# EAGLE design Mega_Shield-v4 (EAGLE 6.5.0)
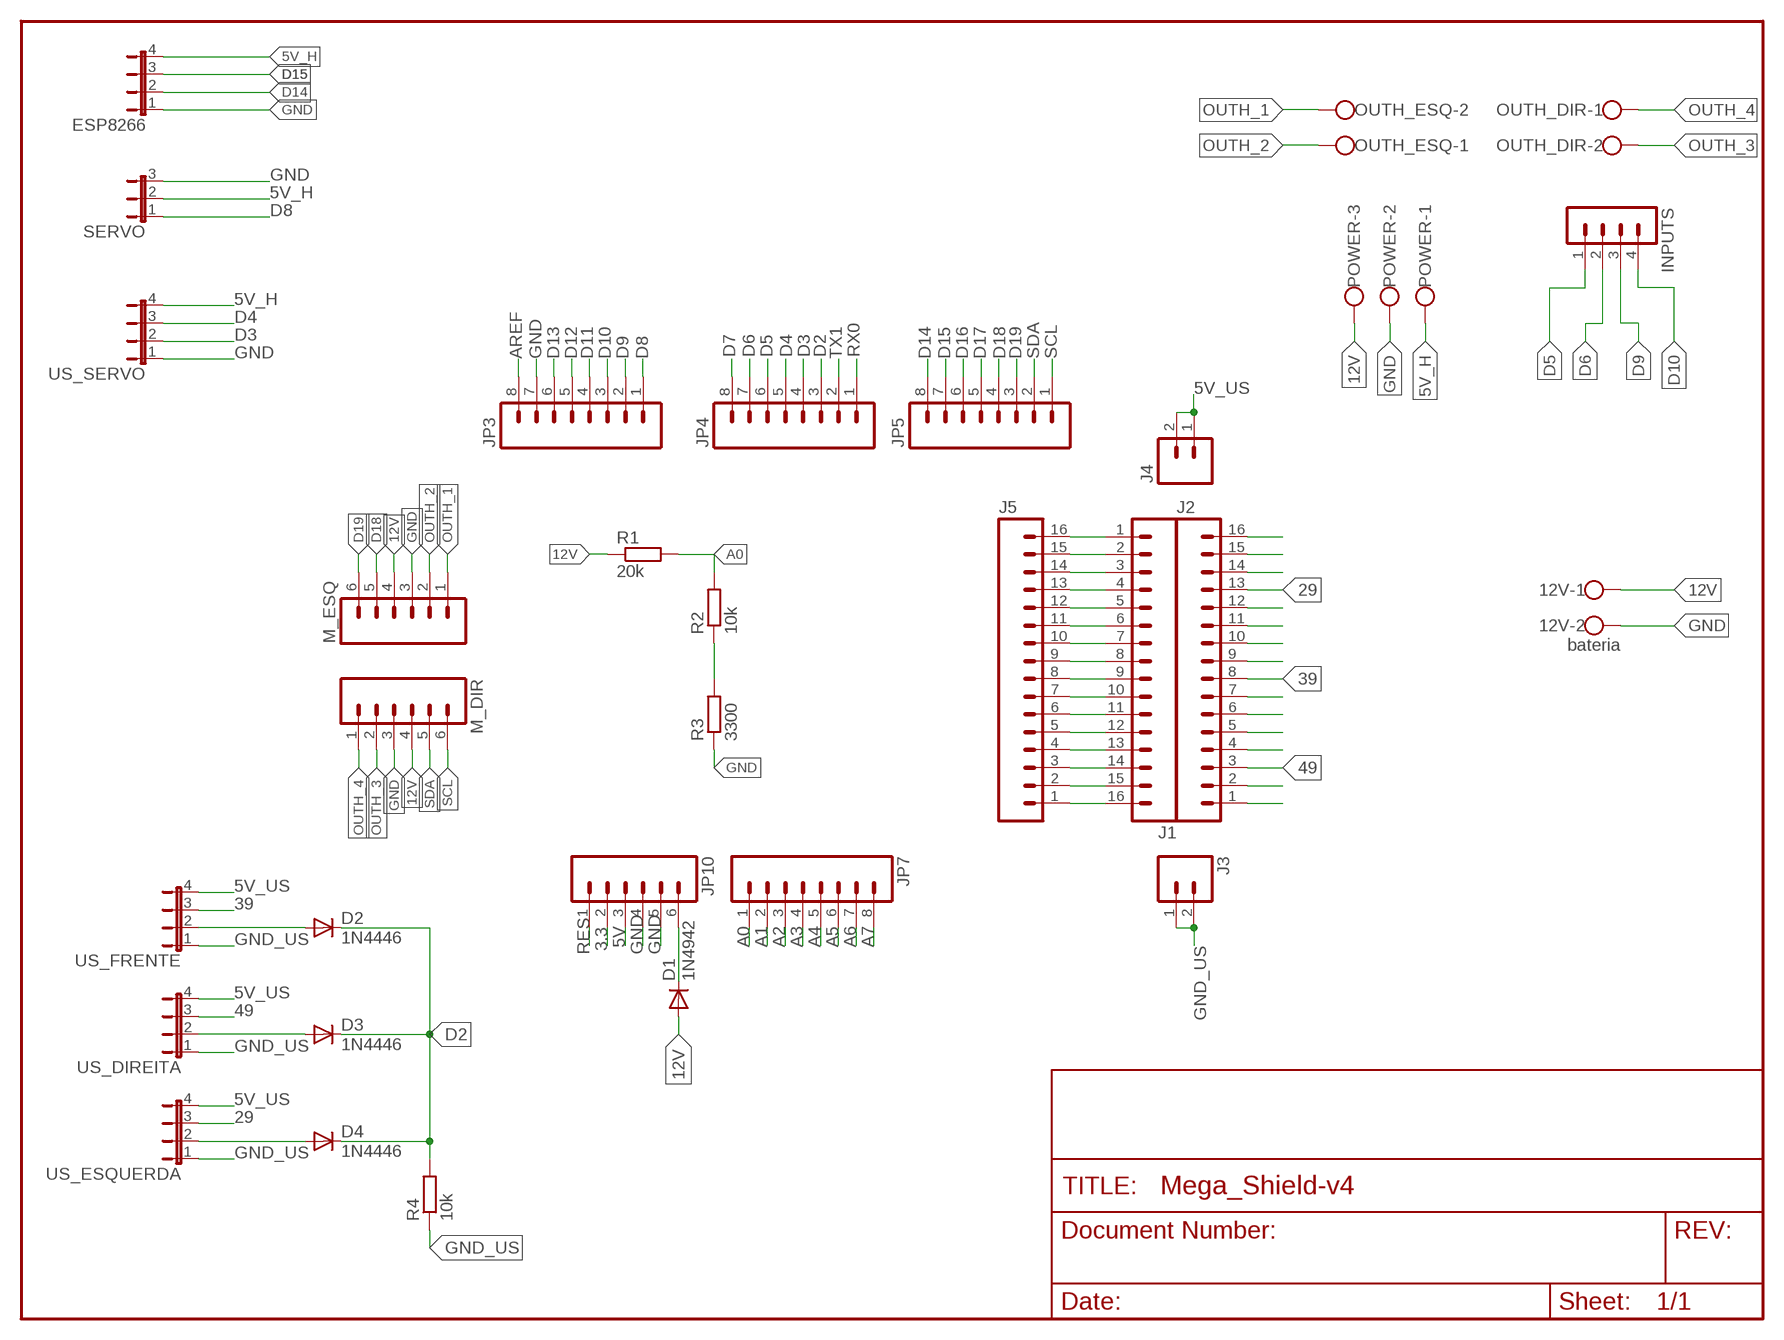
[diagram p0: schematic, sheet 1]

## Parts
12V  bateria  W237-102  [W237-102]
D1  1N4942  [DO41-10]
D2  1N4446  [DO35-10]
D3  1N4446  [DO35-10]
D4  1N4446  [DO35-10]
ESP8266  JP4E  [JP4]
INPUTS  MA04-1  [MA04-1]
J1  M16LOCK  [1X16_LOCK]
J2  M16LOCK  [1X16_LOCK]
J3  M02LOCK  [1X02_LOCK]
J4  M02LOCK  [1X02_LOCK]
J5  M16LOCK  [1X16_LOCK]
JP3  M08LOCK  [1X08_LOCK]
JP4  M08LOCK  [1X08_LOCK]
JP5  M08LOCK  [1X08_LOCK]
JP7  M08LOCK  [1X08_LOCK]
JP10  M06LOCK  [1X06_LOCK]
M_DIR  M06LOCK  [1X06_LOCK]
M_ESQ  M06LOCK  [1X06_LOCK]
OUTH_DIR  W237-102  [W237-102]
OUTH_ESQ  W237-102  [W237-102]
POWER  W237-103  [W237-103]
R1  20k  R-EU_0207/10  [0207/10]
R2  10k  R-EU_0207/10  [0207/10]
R3  3300  R-EU_0207/10  [0207/10]
R4  10k  R-EU_0207/10  [0207/10]
SERVO  JP2W  [JP2W]
US_DIREITA  JP4E  [JP4]
US_ESQUERDA  JP4E  [JP4]
US_FRENTE  JP4E  [JP4]
US_SERVO  JP4E  [JP4]

## Nets
3.3: JP10.2
5V: JP10.3
5V_H: ESP8266.4 POWER.1 SERVO.2 US_SERVO.4
5V_US: J4.1 J4.2 US_DIREITA.4 US_ESQUERDA.4 US_FRENTE.4
12V: 12V.1 D1.A M_DIR.4 M_ESQ.4 POWER.3 R1.1
29: J2.13 US_ESQUERDA.3
39: J2.8 US_FRENTE.3
49: J2.3 US_DIREITA.3
A0: JP7.1 R1.2 R2.2
A1: JP7.2
A2: JP7.3
A3: JP7.4
A4: JP7.5
A5: JP7.6
A6: JP7.7
A7: JP7.8
AREF: JP3.8
D2: D2.C D3.C D4.C JP4.3 R4.2
D3: JP4.4 US_SERVO.2
D4: JP4.5 US_SERVO.3
D5: INPUTS.1 JP4.6
D6: INPUTS.2 JP4.7
D7: JP4.8
D8: JP3.1 SERVO.1
D9: INPUTS.3 JP3.2
D10: INPUTS.4 JP3.3
D11: JP3.4
D12: JP3.5
D13: JP3.6
D14: ESP8266.2 JP5.8
D15: ESP8266.3 JP5.7
D16: JP5.6
D17: JP5.5
D18: JP5.4 M_ESQ.5
D19: JP5.3 M_ESQ.6
GND: 12V.2 ESP8266.1 JP3.7 JP10.4 JP10.5 M_DIR.3 M_ESQ.3 POWER.2 R3.1 SERVO.3 US_SERVO.1
GND_US: J3.1 J3.2 R4.1 US_DIREITA.1 US_ESQUERDA.1 US_FRENTE.1
N$2: R2.1 R3.2
N$8: D1.C JP10.6
N$10: J2.16
N$12: D2.A US_FRENTE.2
N$13: J1.16 J5.1
N$14: D3.A US_DIREITA.2
N$15: J2.15
N$16: J2.14
N$17: J1.15 J5.2
N$18: J1.14 J5.3
N$19: J2.12
N$20: J2.11
N$21: J1.13 J5.4
N$22: D4.A US_ESQUERDA.2
N$23: J2.10
N$25: J2.9
N$26: J1.12 J5.5
N$27: J2.7
N$28: J2.6
N$29: J2.5
N$30: J2.4
N$31: J1.11 J5.6
N$32: J2.2
N$33: J2.1
N$34: J1.10 J5.7
N$35: J1.9 J5.8
N$36: J1.8 J5.9
N$37: J1.7 J5.10
N$38: J1.6 J5.11
N$39: J1.5 J5.12
N$40: J1.4 J5.13
N$41: J1.3 J5.14
N$42: J1.2 J5.15
N$43: J1.1 J5.16
OUTH_1: M_ESQ.1 OUTH_ESQ.2
OUTH_2: M_ESQ.2 OUTH_ESQ.1
OUTH_3: M_DIR.2 OUTH_DIR.2
OUTH_4: M_DIR.1 OUTH_DIR.1
RES: JP10.1
RX0: JP4.1
SCL: JP5.1 M_DIR.6
SDA: JP5.2 M_DIR.5
TX1: JP4.2

## Library data of the parts
12V OUTH_DIR OUTH_ESQ = con-wago-500:W237-102: WAGO SCREW CLAMP; MPN: 237-102; OC_FARNELL: unknown; OC_NEWARK: 70K9898
D1 = diode:1N4942: DIODE 1.0 A, 200 V, 150 ns
D2-D4 = diode:1N4446: DIODE high speed (Philips)
ESP8266 US_DIREITA US_ESQUERDA US_FRENTE US_SERVO = jumper:JP4E: JUMPER
INPUTS = con-lstb:MA04-1: PIN HEADER; OC_FARNELL: unknown; OC_NEWARK: unknown
J1 J2 J5 = SparkFun-Connectors:M16: 1x16 .1" header
J3 J4 = SparkFun-Connectors:M02: Standard 2-pin 0.1" header. Use with - straight break away headers ( PRT-00116) - right angle break away headers (PRT-00553) - swiss pins (PRT-00743) - machine pins (PRT-00117) - female headers (PRT-00115) Molex polarized connector foot print use with: PRT-08233 with associated crimp pins and housings. 2.54_SCREWTERM for use with PRT-10571. 3.5mm Screw Terminal footprints for PRT-08084 5mm Screw Terminal footprints for use with PRT-08432
JP3-JP5 JP7 = SparkFun:M08: Header 8 Standard 8-pin 0.1" header. Use with straight break away headers (SKU : PRT-00116), right angle break away headers (PRT-00553), swiss pins (PRT-00743), machine pins (PRT-00117), and female headers (PRT-00115).
JP10 M_DIR M_ESQ = SparkFun:M06: Header 6 Standard 6-pin 0.1" header. Use with straight break away headers (SKU : PRT-00116), right angle break away headers (PRT-00553), swiss pins (PRT-00743), machine pins (PRT-00117), and female headers (PRT-00115). Molex polarized connector foot print use with SKU : PRT-08094 with associated crimp pins and housings. NOTES ON THE VARIANTS LOCK and LOCK_LONGPADS... This footprint was designed to help hold the alignment of a through-hole component (i.e. 6-pin header) while soldering it into place. You may notice that each hole has been shifted either up or down by 0.005 of an inch from it's more standard position (which is a perfectly straight line). This slight alteration caused the pins (the squares in the middle) to touch the edges of the holes. Because they are alternating, it causes a "brace" to hold the component in place. 0.005 has proven to be the perfect amount of "off-center" position when using our standard breakaway headers. Although looks a little odd when you look at the bare footprint, once you have a header in there, the alteration is very hard to notice. Also, if you push a header all the way into place, it is covered up entirely on the bottom side. This idea of altering the position of holes to aid alignment will be further integrated into the Sparkfun Library for other footprints. It can help hold any component with 3 or more connection pins.
POWER = con-wago-500:W237-103: WAGO SCREW CLAMP; MPN: 237-103; OC_FARNELL: unknown; OC_NEWARK: 18M7116
R1-R4 = resistor:R-EU_: RESISTOR, European symbol
SERVO = jumper:JP2W: JUMPER

## Board
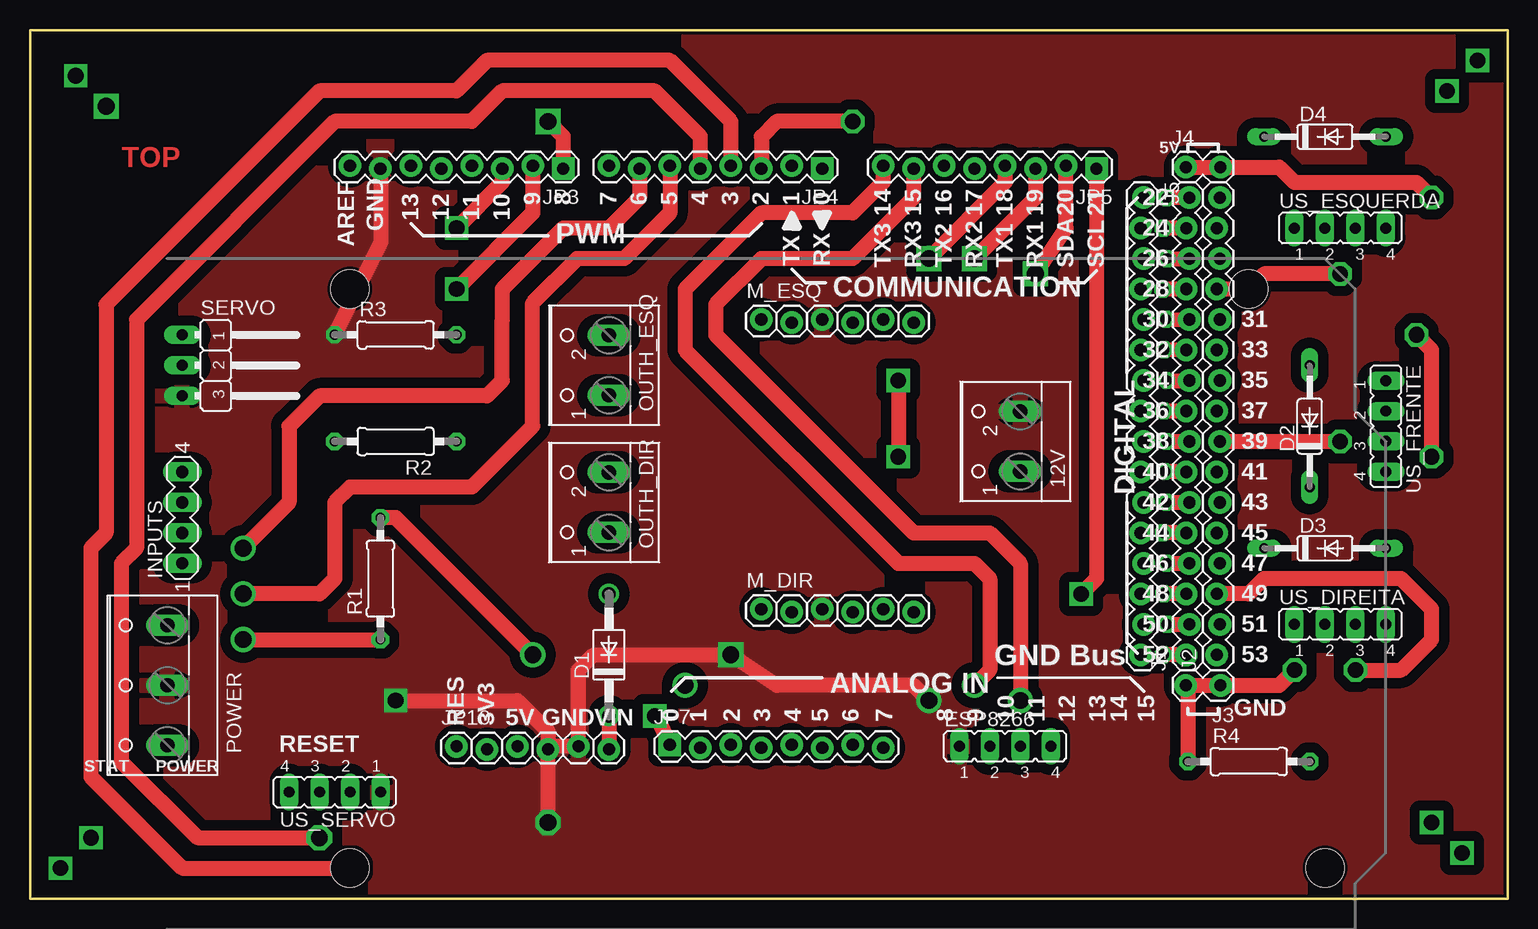
[diagram p1: board, top side]
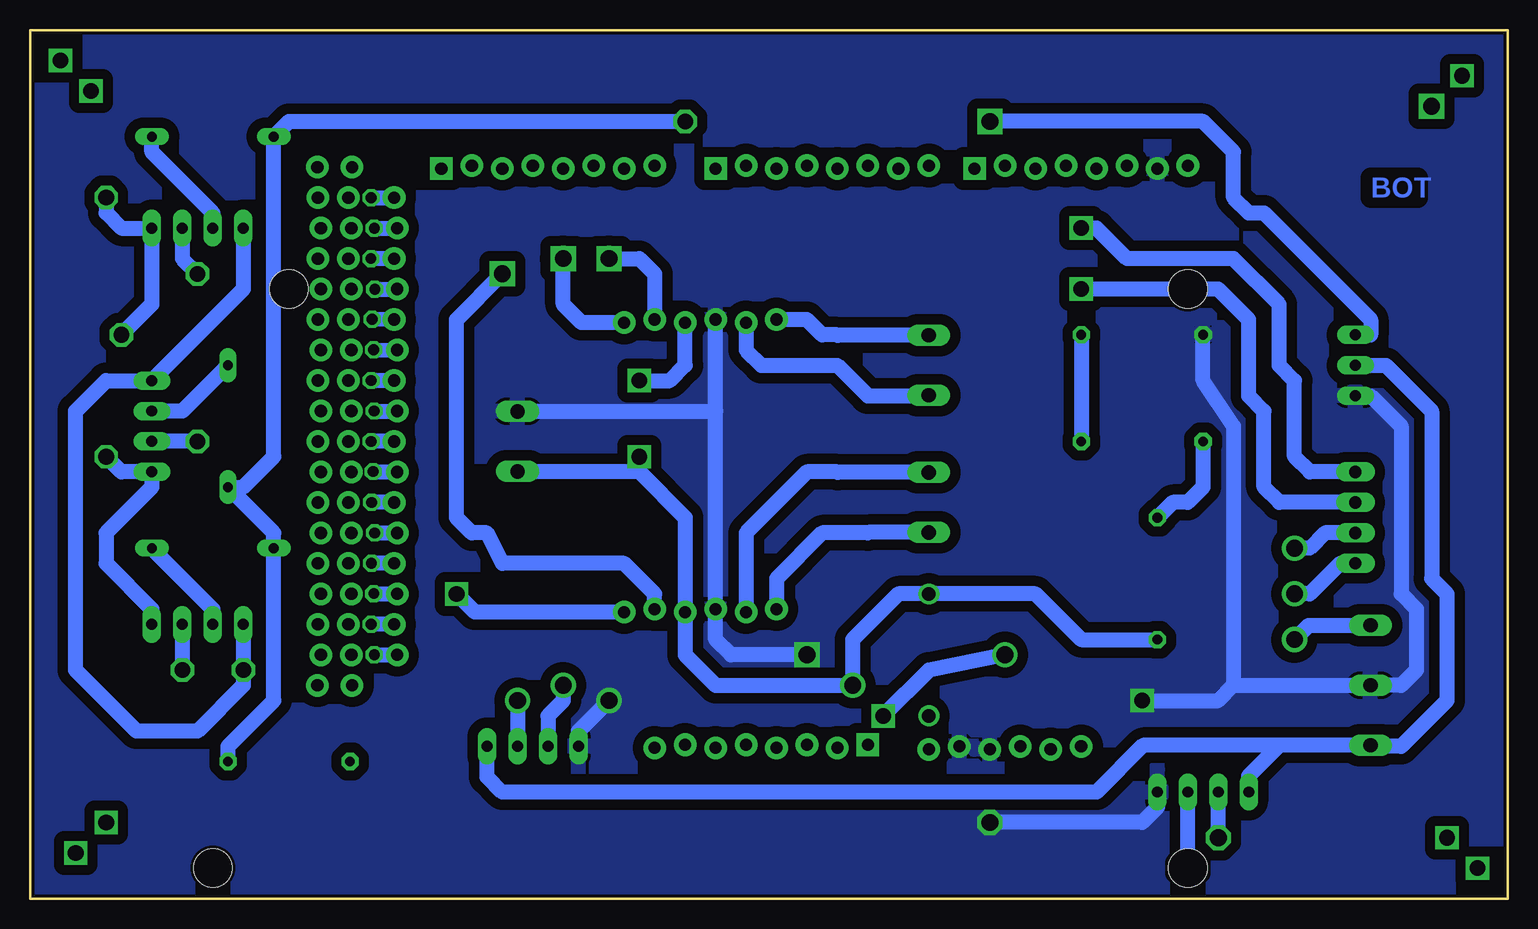
[diagram p2: board, bottom side, seen from below]

Size 123.19 x 72.39 mm. Coordinates in mm from the lower left corner, seen from the top.
Outline: 0,0 123.19,0 123.19,72.39 0,72.39 0,0
Copper layers (1*16): Top 0.035mm / dielectric 1.5mm / Bottom 0.035mm
Design rules "SparkFun *": minimum track width 42mil, minimum drill 34mil, track to track 34mil, track to pad 34mil, pad to pad 34mil, via to via 34mil, smd to smd 8mil, copper to edge 10mil, drill to drill 8mil, minimum pad ring 12mil, minimum via ring 10mil, stop-mask expansion 4mil, vias tented up to drill 25mil, thermal gap 10mil
Holes 3.2 mm at 26.67,50.8 26.67,2.54 101.6,50.8 107.95,2.54

### Footprints (pad centres in the part's own frame; a part is rotated, then mirrored left to right if it is on the bottom)
W237-102 = drill 1.194 long: 1 -2.5,-1.27; 2 2.5,-1.27
DO41-10 = drill 1.118: A 5.08,0; C -5.08,0
DO35-10 = drill 0.813 long: A 5.08,0; C -5.08,0
JP4 = drill 0.914 long: 1 -3.81,0; 2 -1.27,0; 3 1.27,0; 4 3.81,0
MA04-1 = drill 1.016 long: 1 -3.81,0; 2 -1.27,0; 3 1.27,0; 4 3.81,0
1X16_LOCK = drill 1.016 pad 1.88: 1 0,0.127; 2 2.54,-0.127; 3 5.08,0.127; 4 7.62,-0.127; 5 10.16,0.127; 6 12.7,-0.127; 7 15.24,0.127; 8 17.78,-0.127; 9 20.32,0.127; 10 22.86,-0.127; 11 25.4,0.127; 12 27.94,-0.127; 13 30.48,0.127; 14 33.02,-0.127; 15 35.56,0.127; 16 38.1,-0.127
1X02_LOCK = drill 1.016 pad 1.88: 1 -0.178,0; 2 2.718,0
1X08_LOCK = drill 1.016 pad 1.88 square: 1 0,0.127 | drill 1.016 pad 1.88: 2 2.54,-0.127; 3 5.08,0.127; 4 7.62,-0.127; 5 10.16,0.127; 6 12.7,-0.127; 7 15.24,0.127; 8 17.78,-0.127
1X06_LOCK = drill 1.016 pad 1.88: 1 0,0; 2 2.54,-0.254; 3 5.08,0; 4 7.62,-0.254; 5 10.16,0; 6 12.7,-0.254
W237-103 = drill 1.194 long: 1 -5,-1.29; 2 0,-1.29; 3 5,-1.29
0207/10 = drill 0.813 octagon: 1 -5.08,0; 2 5.08,0
JP2W = drill 0.914 long: 1 -2.54,-1.27; 2 0,-1.27; 3 2.54,-1.27

### Placement (x,y rotation side)
12V  81.28,38.1 90 top
D1  48.26,20.32 90 top
D2  106.68,39.37 90 top
D3  107.95,29.21 0 top
D4  107.95,63.5 0 top
ESP8266  81.28,12.7 0 top
INPUTS  12.7,31.75 90 top
J1  96.52,20.32 90 top
J2  99.06,20.32 90 top
J3  99.06,17.78 180 top
J4  96.52,60.96 0 top
J5  92.71,58.42 270 top
JP3  44.45,60.96 180 top
JP4  66.04,60.96 180 top
JP5  88.9,60.96 180 top
JP7  53.34,12.7 0 top
JP10  35.56,12.7 0 top
M_DIR  60.96,24.13 0 top
M_ESQ  60.96,48.26 0 top
OUTH_DIR  46.99,33.02 90 top
OUTH_ESQ  46.99,44.45 90 top
POWER  10.16,17.78 90 top
R1  29.21,26.67 90 top
R2  30.48,38.1 180 top
R3  30.48,46.99 0 top
R4  101.6,11.43 0 top
SERVO  13.97,44.45 270 top
US_DIREITA  109.22,22.86 0 top
US_ESQUERDA  109.22,55.88 0 top
US_FRENTE  113.03,39.37 270 top
US_SERVO  25.4,8.89 180 top

### Tracks (layer width: path | path; a pad name or v marks a point on that pad's centre or on a via)
5V_H
  Bottom 1.27: 19.05,12.78 POWER.1 11.37,12.7 8.89,12.7 5.08,16.51 5.08,25.4 6.35,26.67 6.35,40.64 10.16,44.45 SERVO.2 | 19.05,12.78 30.4,12.78 34.29,8.89 83.82,8.89 85.09,10.16 ESP8266.4 | US_SERVO.4 21.59,10.24 19.05,12.78
5V_US  (via drill 1.3)
  Top 1.27: J4.1 J4.2 104.14,60.96 105.41,59.69 115.57,59.69 v116.84,58.42 | v116.84,36.83 116.84,45.72 v115.57,46.99
  Bottom 1.27: US_DIREITA.4 113.03,24.13 116.84,27.94 116.84,30.48 113.03,34.29 US_FRENTE.4 115.57,35.56 v116.84,36.83 | v115.57,46.99 113.03,49.53 US_ESQUERDA.4 115.57,55.88 116.84,57.15 v116.84,58.42
12V  (via drill 0.9, 1.3, 1.4)
  Top 1.27: v72.39,43.18 v72.39,36.83 | v17.78,21.59 R1.1
  Bottom 0.813: 72.43,35.6 72.39,35.56 v72.39,36.83
  Bottom 1.27: 12V.1 72.43,35.6 | 72.39,35.56 68.58,31.75 M_DIR.4 68.58,20.32 66.04,17.78 v54.61,17.78 54.61,21.59 50.8,25.4 D1.A 39.37,25.4 35.56,21.59 R1.1 | v72.39,43.18 69.85,43.18 68.58,44.45 M_ESQ.4 | v17.78,21.59 16.59,22.78 POWER.3
29  (via drill 1.3)
  Top 1.27: v109.22,52.07 102.87,52.07 101.6,50.8 J2.13
  Bottom 1.27: US_ESQUERDA.3 110.49,53.34 v109.22,52.07
39  (via drill 1.3)
  Top 1.27: J2.8 v109.22,38.1
  Bottom 1.27: v109.22,38.1 US_FRENTE.3
49  (via drill 1.3)
  Top 1.27: v110.49,19.05 114.3,19.05 116.84,21.59 116.84,24.13 114.3,26.67 102.87,26.67 101.6,25.4 J2.3
  Bottom 1.27: US_DIREITA.3 v110.49,19.05
A0  (via drill 0.9, 1.3, 1.4)
  Top 0.813: v52.07,15.24 52.2,15.24
  Top 1.27: 52.2,15.24 JP7.1 | v41.91,20.32 30.48,31.75 R1.2
  Bottom 1.27: R2.2 25.4,34.29 26.67,33.02 27.94,33.02 R1.2 | v41.91,20.32 48.26,19.05 v52.07,15.24
D2  (via drill 1.3)
  Top 1.27: v68.58,64.77 62.23,64.77 60.96,63.5 JP4.3
  Bottom 1.27: R4.2 106.68,12.7 102.87,16.51 D3.C 102.87,30.48 D2.C 105.41,34.29 102.87,36.83 D4.C 101.6,64.77 v68.58,64.77
D3  (via drill 1.4)
  Top 1.27: JP4.4 58.42,64.77 53.34,69.85 38.1,69.85 35.56,67.31 24.13,67.31 6.35,49.53 6.35,30.48 5.08,29.21 5.08,10.16 12.7,2.54 v26.67,2.54
  Bottom 1.27: v26.67,2.54 US_SERVO.2
D4  (via drill 1.4)
  Top 1.27: JP4.5 55.88,63.5 52.07,67.31 39.37,67.31 36.83,64.77 25.4,64.77 8.89,48.26 8.89,29.21 7.62,27.94 7.62,11.43 13.97,5.08 v24.13,5.08
  Bottom 1.27: v24.13,5.08 US_SERVO.3
D5  (via drill 1.2, 1.4)
  Top 1.27: JP4.6 53.34,57.15 49.53,53.34 45.59,53.34 41.91,49.66 41.91,39.37 36.83,34.29 26.67,34.29 25.4,33.02 25.4,26.67 24.13,25.4 v17.78,25.4
  Bottom 1.27: INPUTS.1 13.97,27.94 16.51,25.4 v17.78,25.4
D6  (via drill 0.6, 1.2, 1.3, 1.4)
  Top 0.813: 39.37,48.26 39.37,49.53
  Top 1.27: JP4.7 50.8,58.42 48.26,55.88 44.45,55.88 39.37,50.8 39.37,48.26 39.37,43.18 38.1,41.91 24.13,41.91 21.59,39.37 21.59,33.02 v17.78,29.21
  Bottom 1.27: INPUTS.2 15.24,30.48 16.51,29.21 v17.78,29.21
D8  (via drill 1.4)
  Top 1.27: v43.18,64.77 44.45,63.5 JP3.1
  Bottom 1.27: SERVO.1 11.43,46.99 11.43,48.26 20.32,57.15 21.59,57.15 22.86,58.42 22.86,62.23 25.4,64.77 v43.18,64.77
D9  (via drill 0.9, 1.3)
  Top 1.27: JP3.2 41.91,57.15 v35.56,50.8
  Bottom 1.27: v35.56,50.8 24.13,50.8 21.59,48.26 21.59,41.91 20.32,40.64 20.32,34.29 19.05,33.02 INPUTS.3
D10  (via drill 0.9, 1.3)
  Top 1.27: JP3.3 39.37,59.69 v35.56,55.88
  Bottom 1.27: v35.56,55.88 34.29,55.88 31.75,53.34 22.86,53.34 19.05,49.53 19.05,44.45 17.78,43.18 17.78,36.83 16.51,35.56 INPUTS.4
D14  (via drill 1.4)
  Top 1.27: JP5.8 71.12,59.69 68.58,57.15 60.96,57.15 54.61,50.8 54.61,45.72 72.39,27.94 78.74,27.94 80.01,26.67 80.01,19.05 v78.74,17.78
  Bottom 1.27: v78.74,17.78 78.74,16.51 80.01,15.24 ESP8266.2
D15  (via drill 1.4)
  Top 1.27: JP5.7 73.66,58.42 68.58,53.34 60.96,53.34 57.15,49.53 57.15,46.99 73.66,30.48 80.01,30.48 82.55,27.94 v82.55,16.51
  Bottom 1.27: v82.55,16.51 ESP8266.3
D18  (via drill 1.4)
  Top 1.27: JP5.4 81.28,59.69 v74.93,53.34
  Bottom 1.27: v74.93,53.34 72.39,53.34 71.12,52.07 M_ESQ.5
D19  (via drill 0.9, 1.4)
  Top 1.27: JP5.3 83.82,58.42 v78.74,53.34
  Bottom 1.27: M_ESQ.6 77.22,48.01 78.74,49.53 v78.74,53.34
GND  (via drill 0.9, 1.3, 1.4)
  Top 0.813: 43.43,12.7 JP10.4
  Top 1.27: JP3.7 29.21,54.61 R3.1 | v30.48,16.51 40.64,16.51 43.18,13.97 JP10.4 v43.18,6.35 | 43.43,12.7 JP10.5 45.72,19.05 46.99,20.32 v58.42,20.32 62.23,17.78 73.66,17.78 v74.93,16.51
  Bottom 0.813: 66.08,40.6 66.04,40.64
  Bottom 1.27: R3.1 25.4,43.18 22.86,39.37 22.86,17.78 | v58.42,20.32 64.77,20.32 66.04,21.59 M_DIR.3 66.04,40.64 M_ESQ.3 | 12V.2 66.08,40.6 | 22.86,17.78 POWER.2 8.89,17.78 7.62,19.05 7.62,24.13 8.89,25.4 8.89,39.37 11.43,41.91 SERVO.3 | v30.48,16.51 24.13,16.51 22.86,17.78 | ESP8266.1 77.47,13.97 v74.93,16.51 | US_SERVO.1 29.21,7.62 30.48,6.35 v43.18,6.35
  pour Bottom: 0,72.39 0,0 123.19,0 123.19,72.39
  pour Top: 0,72.39 0,0 123.19,0 123.19,72.39
GND_US  (via drill 1.3)
  Top 1.27: R4.1 96.52,17.78 J3.2 J3.1 104.14,17.78 v105.41,19.05
  Bottom 1.27: US_DIREITA.1 v105.41,19.05 105.41,17.78 109.22,13.97 114.3,13.97 119.38,19.05 119.38,40.64 116.84,43.18 US_FRENTE.1 105.41,50.8 US_ESQUERDA.1
N$2
  Bottom 1.27: R3.2 R2.1
N$3  (via drill 1.3)
  other vias: 3.81,68.58
N$4  (via drill 1.3)
  other vias: 120.65,69.85
N$5  (via drill 1.3)
  other vias: 116.84,6.35
N$6  (via drill 1.3)
  other vias: 2.54,2.54
N$7  (via drill 1.3)
  other vias: 5.08,5.08
N$8
  Top 1.27: D1.C JP10.6
N$9  (via drill 1.4)
  other vias: 6.35,66.04
N$11  (via drill 1.3)
  other vias: 118.11,67.31
N$12
  Bottom 1.27: D2.A 110.49,40.64 US_FRENTE.2
N$13  (via drill 0.9)
  Top 1.27: J1.16 v94.74,58.41
  Bottom 1.27: v94.74,58.41 J5.1
N$14
  Bottom 1.27: D3.A 107.95,24.13 US_DIREITA.2
N$17  (via drill 0.9)
  Top 1.27: J1.15 v94.49,55.88
  Bottom 1.27: v94.49,55.88 J5.2
N$18  (via drill 0.9)
  Top 1.27: v94.77,53.34 J1.14
  Bottom 1.27: J5.3 v94.77,53.34
N$21  (via drill 0.9)
  Top 1.27: J1.13 v94.44,50.79
  Bottom 1.27: v94.44,50.79 J5.4
N$22
  Bottom 1.27: US_ESQUERDA.2 107.95,57.15 113.03,62.23 D4.A
N$24  (via drill 1.3)
  other vias: 119.38,3.81
N$26  (via drill 0.9)
  Top 1.27: v94.68,48.27 J1.12
  Bottom 1.27: J5.5 v94.68,48.27
N$31  (via drill 0.9)
  Top 1.27: J1.11 v94.54,45.73
  Bottom 1.27: v94.54,45.73 J5.6
N$34  (via drill 0.9)
  Top 1.27: v94.75,43.18 J1.10
  Bottom 1.27: J5.7 v94.75,43.18
N$35  (via drill 0.9)
  Top 1.27: J1.9 v94.5,40.64
  Bottom 1.27: v94.5,40.64 J5.8
N$36  (via drill 0.9)
  Top 1.27: v94.75,38.1 J1.8
  Bottom 1.27: J5.9 v94.75,38.1
N$37  (via drill 0.9)
  Top 1.27: J1.7 v94.59,35.59
  Bottom 1.27: v94.59,35.59 J5.10
N$38  (via drill 0.9)
  Top 1.27: v94.72,33.02 J1.6
  Bottom 1.27: J5.11 v94.72,33.02
N$39  (via drill 0.9)
  Top 1.27: J1.5 v94.45,30.48
  Bottom 1.27: v94.45,30.48 J5.12
N$40  (via drill 0.9)
  Top 1.27: v94.73,27.96 J1.4
  Bottom 1.27: J5.13 v94.73,27.96
N$41  (via drill 0.9)
  Top 1.27: J1.3 v94.53,25.43
  Bottom 1.27: v94.53,25.43 J5.14
N$42  (via drill 0.9)
  Top 1.27: v94.75,22.87 J1.2
  Bottom 1.27: J5.15 v94.75,22.87
N$43  (via drill 0.9)
  Top 1.27: J1.1 v94.49,20.33
  Bottom 1.27: v94.49,20.33 J5.16
OUTH_1
  Bottom 0.813: 55.84,46.95 55.88,46.99
  Bottom 1.27: OUTH_ESQ.2 55.84,46.95 | 55.88,46.99 57.15,46.99 58.42,48.26 M_ESQ.1
OUTH_2
  Bottom 0.813: 48.3,41.91 OUTH_ESQ.1
  Bottom 1.27: M_ESQ.2 63.5,45.72 62.23,44.45 55.88,44.45 53.34,41.91 48.3,41.91
OUTH_3
  Bottom 1.27: OUTH_DIR.2 55.84,35.52 55.88,35.56 58.42,35.56 63.5,30.48 M_DIR.2
OUTH_4
  Bottom 1.27: OUTH_DIR.1 53.3,30.52 53.34,30.48 57.15,30.48 60.96,26.67 M_DIR.1
SCL  (via drill 0.9, 1.3)
  Top 1.27: JP5.1 88.9,26.67 v87.63,25.4
  Bottom 1.27: M_DIR.6 86.11,23.88 v87.63,25.4
SDA  (via drill 0.9, 1.4)
  Top 1.27: v83.82,52.07 86.36,55.88 JP5.2
  Bottom 1.27: M_DIR.5 71.12,25.4 73.66,27.94 83.82,27.94 85.09,30.48 86.36,30.48 87.63,31.75 87.63,48.26 v83.82,52.07

### Text on the board
Top: TOP
Bottom: BOT
tPlace: 5V | 9 | 8 | 7 | 6 | 5 | 4 | 3 | 2 | 1 | 0 | 22 | 13 | 12 | 11 | 10 | 14 | 15 | 16 | 17 | 18 | 19 | 20 | 21 | GND | PWM | 24 | AREF | TX | RX | TX3 | RX3 | TX2 | RX2 | TX1 | RX1 | SDA | SCL | 26 | COMMUNICATION | 28 | 30 | 31 | 32 | 33 | 34 | 35 | 36 | 37 | 38 | 39 | 40 | 41 | DIGITAL | 42 | 43 | 44 | 45 | 46 | 47 | 48 | 49 | 50 | 51 | 52 | 53 | GND Bus | ANALOG IN | 0 | 1 | 2 | 3 | 4 | 5 | 6 | 7 | 8 | 9 | 10 | 11 | 12 | 13 | 14 | 15 | GND | RES | 3V3 | 5V | GND | VIN | RESET | STAT | POWER